# EAGLE design lcd_handle (EAGLE 5.12)

## Sheet 1 of 2
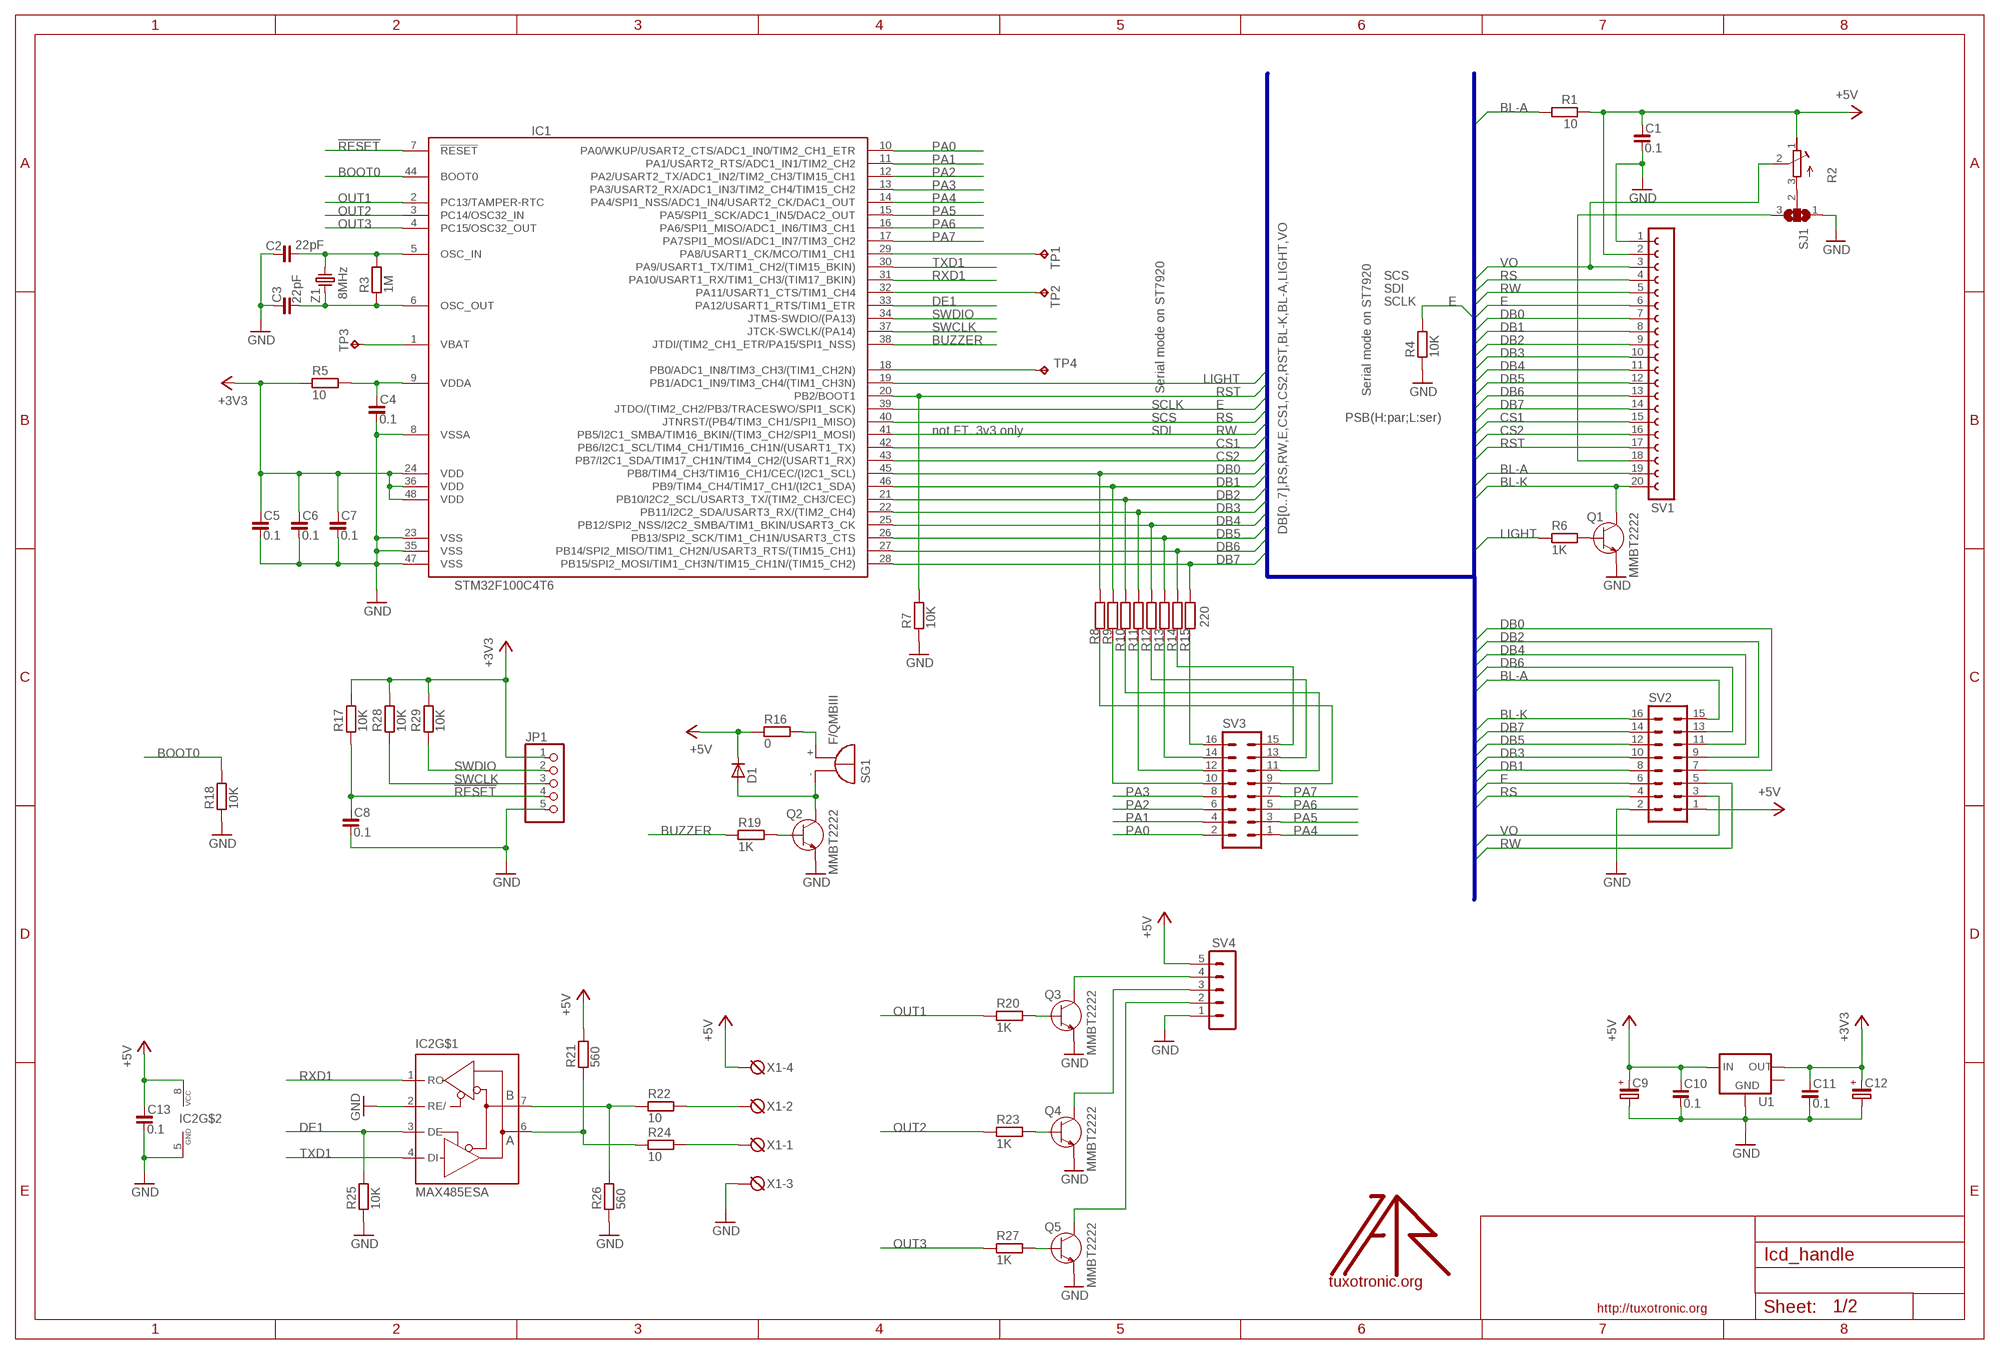
[diagram p0: schematic, sheet 1]

### Parts
C1  0.1  C_0805  [C0805]
C2  22pF  C_0603  [C0603]
C3  22pF  C_0603  [C0603]
C4  0.1  C_0603  [C0603]
C5  0.1  C_0603  [C0603]
C6  0.1  C_0603  [C0603]
C7  0.1  C_0603  [C0603]
C8  0.1  C_0603  [C0603]
C9  CP_SMCD  [SMC_D]
C10  0.1  C_0805  [C0805]
C11  0.1  C_0805  [C0805]
C12  CP_SMCD  [SMC_D]
C13  0.1  C_0603  [C0603]
D1  D-SOD-80  [SOD80]
IC1  STM32F100C4T6  [LQFP48]
IC2  MAX485ESA  MAX487-S  [SO08]
JP1  PINHD-1X5_2.00  [1X05M]
Q1  MMBT2222  BC847C  [SOT23]
Q2  MMBT2222  BC847C  [SOT23]
Q3  MMBT2222  BC847C  [SOT23]
Q4  MMBT2222  BC847C  [SOT23]
Q5  MMBT2222  BC847C  [SOT23]
R1  10  R_0805  [R0805]
R2  RTRIM  [RTRIM-3362P]
R3  1M  R_0603  [R0603]
R4  10K  R_0603  [R0603]
R5  10  R_0603  [R0603]
R6  1K  R_0603  [R0603]
R7  10K  R_0603  [R0603]
R8  220  R_0603  [R0603]
R9  220  R_0603  [R0603]
R10  220  R_0603  [R0603]
R11  220  R_0603  [R0603]
R12  220  R_0603  [R0603]
R13  220  R_0603  [R0603]
R14  220  R_0603  [R0603]
R15  220  R_0603  [R0603]
R16  0  R_0603  [R0603]
R17  10K  R_0603  [R0603]
R18  10K  R_0603  [R0603]
R19  1K  R_0603  [R0603]
R20  1K  R_0603  [R0603]
R21  560  R_0603  [R0603]
R22  10  R_0603  [R0603]
R23  1K  R_0603  [R0603]
R24  10  R_0603  [R0603]
R25  10K  R_0603  [R0603]
R26  560  R_0603  [R0603]
R27  1K  R_0603  [R0603]
R28  10K  R_0603  [R0603]
R29  10K  R_0603  [R0603]
SG1  F/QMBIII  [F/QMBIII]
SJ1  SJ2W  [SJ_2]
SV1  FE20-1  [FE20]
SV2  MA08-2  [MA08-2]
SV3  ML16L  [ML16L]
SV4  MA05-1  [MA05-1]
TP1  TPB1,27  [B1,27]
TP2  TPB1,27  [B1,27]
TP3  TPB1,27  [B1,27]
TP4  TPB1,27  [B1,27]
U1  LM1117-3.3  [SOT223]
U$  LOGO  [TT_LOGO]
X1  DG3XX-04-3.5  [DG350-3.5-04P]
Z1  8MHz  CRYSTAL-HC49S  [HC49/S]

### Nets
!RESET: C8.1 IC1.7(!RESET) JP1.4 R17.1
+3V3: C5.1 C6.1 C7.1 C11.1 C12.+ IC1.24(VDD) IC1.36(VDD) IC1.48(VDD) JP1.1 R5.1 R17.2 R28.2 R29.2 U1.2(OUT)
+5V: C1.1 C9.+ C10.1 C13.1 D1.C IC2.8(VCC) R1.1 R2.1(A) R16.1 R21.2 SV1.2 SV2.1 SV4.5 U1.3(IN) X1.4
BL-A: R1.2 SV1.19 SV2.15
BL-K: Q1.3(C) SV1.20 SV2.16
BOOT0: IC1.44(BOOT0) R18.2
BUZZER: IC1.38(JTDI/(TIM2_CH1_ETR/PA15/SPI1_NSS)) R19.1
CS1: IC1.42(PB6/I2C1_SCL/TIM4_CH1/TIM16_CH1N/(USART1_TX)) SV1.15
CS2: IC1.43(PB7/I2C1_SDA/TIM17_CH1N/TIM4_CH2/(USART1_RX)) SV1.16
DB0: IC1.45(PB8/TIM4_CH3/TIM16_CH1/CEC/(I2C1_SCL)) R8.2 SV1.7 SV2.7
DB1: IC1.46(PB9/TIM4_CH4/TIM17_CH1/(I2C1_SDA)) R9.2 SV1.8 SV2.8
DB2: IC1.21(PB10/I2C2_SCL/USART3_TX/(TIM2_CH3/CEC)) R10.2 SV1.9 SV2.9
DB3: IC1.22(PB11/I2C2_SDA/USART3_RX/(TIM2_CH4)) R11.2 SV1.10 SV2.10
DB4: IC1.25(PB12/SPI2_NSS/I2C2_SMBA/TIM1_BKIN/USART3_CK) R12.2 SV1.11 SV2.11
DB5: IC1.26(PB13/SPI2_SCK/TIM1_CH1N/USART3_CTS) R13.2 SV1.12 SV2.12
DB6: IC1.27(PB14/SPI2_MISO/TIM1_CH2N/USART3_RTS/(TIM15_CH1)) R14.2 SV1.13 SV2.13
DB7: IC1.28(PB15/SPI2_MOSI/TIM1_CH3N/TIM15_CH1N/(TIM15_CH2)) R15.2 SV1.14 SV2.14
DE1: IC1.33(PA12/USART1_RTS/TIM1_ETR) IC2.3(DE) R25.2
E: IC1.39(JTDO/(TIM2_CH2/PB3/TRACESWO/SPI1_SCK)) R4.2 SV1.6 SV2.6
GND: C1.2 C2.1 C3.1 C4.2 C5.2 C6.2 C7.2 C8.2 C9.- C10.2 C11.2 C12.- C13.2 IC1.8(VSSA) IC1.23(VSS) IC1.35(VSS) IC1.47(VSS) IC2.2(RE/) IC2.5(GND) JP1.5 Q1.2(E) Q2.2(E) Q3.2(E) Q4.2(E) Q5.2(E) R4.1 R7.1 R18.1 R25.1 R26.1 SJ1.1 SV1.1 SV2.2 SV4.1 U1.1(GND) X1.3 ; also sheet 2
LIGHT: IC1.19(PB1/ADC1_IN9/TIM3_CH4/(TIM1_CH3N)) R6.1
N$1: R2.3(E) SJ1.2
N$2: IC1.29(PA8/USART1_CK/MCO/TIM1_CH1) TP1.PP(TP)
N$3: Q3.1(B) R20.2
N$4: SJ1.3 SV1.18
N$5: R22.2 X1.2
N$6: Q2.1(B) R19.2
N$7: C4.1 IC1.9(VDDA) R5.2
N$8: D1.A Q2.3(C) SG1.-(+)
N$9: R16.2 SG1.+(-)
N$10: R24.2 X1.1
N$11: Q1.1(B) R6.2
N$12: IC2.7(B) R22.1 R26.2
N$13: IC2.6(A) R21.1 R24.1
N$14: R14.1 SV3.15
N$15: R12.1 SV3.13
N$16: C2.2 IC1.5(OSC_IN) R3.2 Z1.2
N$17: R10.1 SV3.11
N$18: R8.1 SV3.9
N$19: R15.1 SV3.16
N$20: R13.1 SV3.14
N$21: R11.1 SV3.12
N$22: R9.1 SV3.10
N$23: Q4.1(B) R23.2
N$24: Q5.1(B) R27.2
N$25: Q3.3(C) SV4.4
N$26: Q4.3(C) SV4.3
N$27: Q5.3(C) SV4.2
N$28: IC1.1(VBAT) TP3.PP(TP)
N$29: IC1.32(PA11/USART1_CTS/TIM1_CH4) TP2.PP(TP)
N$30: IC1.18(PB0/ADC1_IN8/TIM3_CH3/(TIM1_CH2N)) TP4.PP(TP)
OUT1: IC1.2(PC13/TAMPER-RTC) R20.1
OUT2: IC1.3(PC14/OSC32_IN) R23.1
OUT3: IC1.4(PC15/OSC32_OUT) R27.1
PA0: IC1.10(PA0/WKUP/USART2_CTS/ADC1_IN0/TIM2_CH1_ETR) SV3.2
PA1: IC1.11(PA1/USART2_RTS/ADC1_IN1/TIM2_CH2) SV3.4
PA2: IC1.12(PA2/USART2_TX/ADC1_IN2/TIM2_CH3/TIM15_CH1) SV3.6
PA3: IC1.13(PA3/USART2_RX/ADC1_IN3/TIM2_CH4/TIM15_CH2) SV3.8
PA4: IC1.14(PA4/SPI1_NSS/ADC1_IN4/USART2_CK/DAC1_OUT) SV3.1
PA5: IC1.15(PA5/SPI1_SCK/ADC1_IN5/DAC2_OUT) SV3.3
PA6: IC1.16(PA6/SPI1_MISO/ADC1_IN6/TIM3_CH1) SV3.5
PA7: IC1.17(PA7SPI1_MOSI/ADC1_IN7/TIM3_CH2) SV3.7
RS: IC1.40(JTNRST/(PB4/TIM3_CH1/SPI1_MISO)) SV1.4 SV2.4
RST: IC1.20(PB2/BOOT1) R7.2 SV1.17
RW: IC1.41(PB5/I2C1_SMBA/TIM16_BKIN/(TIM3_CH2/SPI1_MOSI)) SV1.5 SV2.5
RXD1: IC1.31(PA10/USART1_RX/TIM1_CH3/(TIM17_BKIN)) IC2.1(RO)
SWCLK: IC1.37(JTCK-SWCLK/(PA14)) JP1.3 R28.1
SWDIO: IC1.34(JTMS-SWDIO/(PA13)) JP1.2 R29.1
TXD1: IC1.30(PA9/USART1_TX/TIM1_CH2/(TIM15_BKIN)) IC2.4(DI)
VO: R2.2(S) SV1.3 SV2.3
XTAL2: C3.2 IC1.6(OSC_OUT) R3.1 Z1.1
Unconnected: U1.4(MASS)

### Buses
DB[0..7],RS,RW,E,CS1,CS2,RST,BL-K,BL-A,LIGHT,VO

### Notes on the sheet
- SCS
- SDI
- SCLK
- Serial mode on ST7920 | Serial mode on ST7920
- SCLK
- SCS | PSB(H:par;L:ser)
- not FT. 3v3 only | SDI

## Sheet 2 of 2
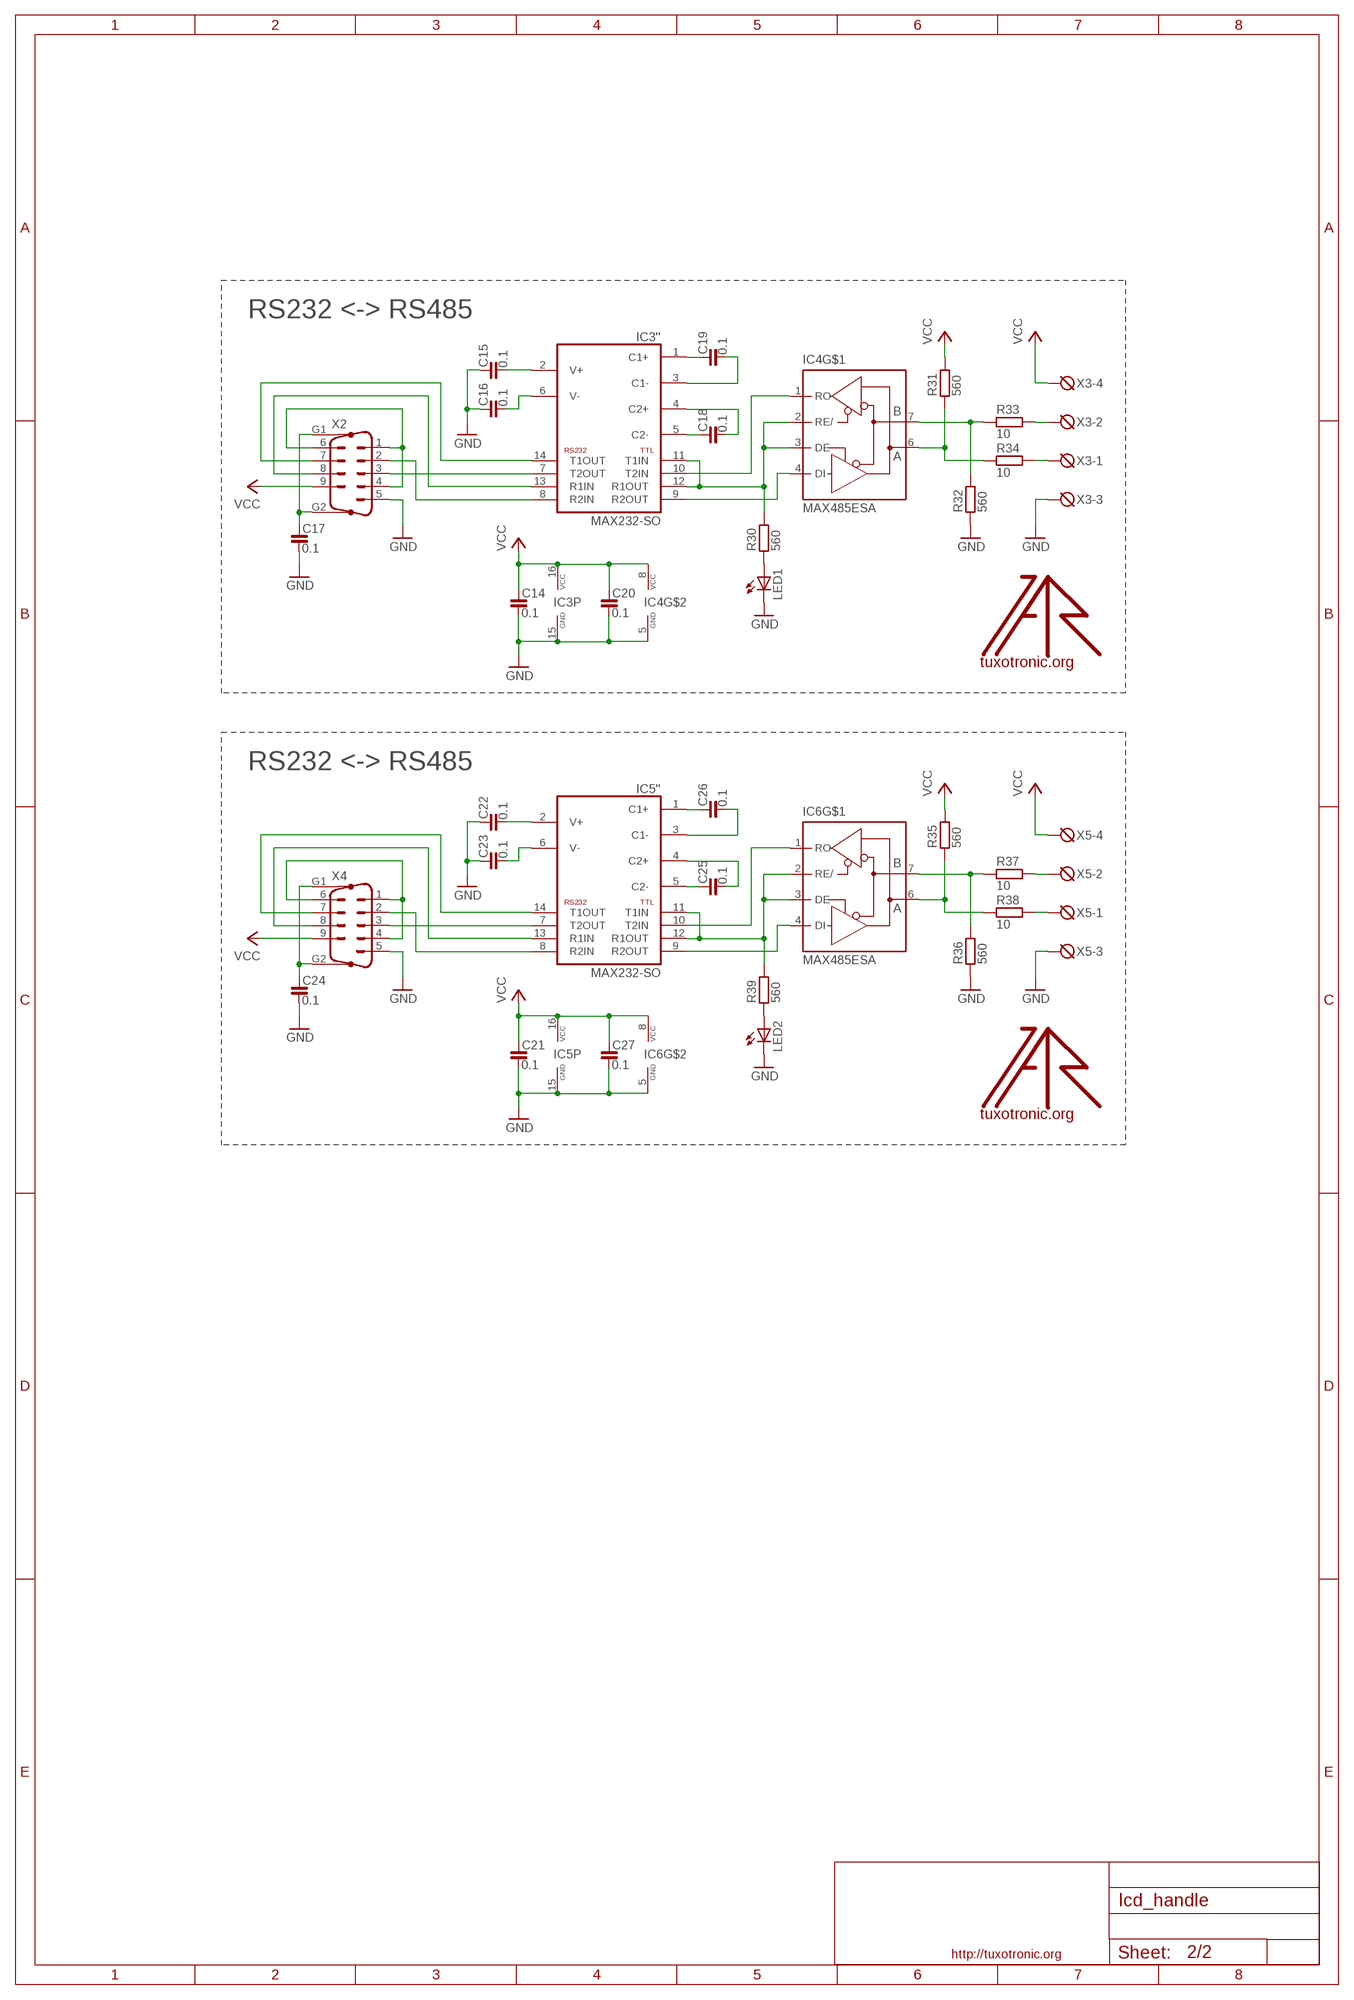
[diagram p1: schematic, sheet 2]

### Parts
C14  0.1  C_0805  [C0805]
C15  0.1  C_0805  [C0805]
C16  0.1  C_0805  [C0805]
C17  0.1  C_1206  [C1206]
C18  0.1  C_0805  [C0805]
C19  0.1  C_0805  [C0805]
C20  0.1  C_0805  [C0805]
C21  0.1  C_0805  [C0805]
C22  0.1  C_0805  [C0805]
C23  0.1  C_0805  [C0805]
C24  0.1  C_1206  [C1206]
C25  0.1  C_0805  [C0805]
C26  0.1  C_0805  [C0805]
C27  0.1  C_0805  [C0805]
IC3  MAX232-SO  [SO16]
IC4  MAX485ESA  MAX487-S  [SO08]
IC5  MAX232-SO  [SO16]
IC6  MAX485ESA  MAX487-S  [SO08]
LED1  LEDCHIP-LED0805  [CHIP-LED0805]
LED2  LEDCHIP-LED0805  [CHIP-LED0805]
R30  560  R_0805  [R0805]
R31  560  R_0805  [R0805]
R32  560  R_0805  [R0805]
R33  10  R_0805  [R0805]
R34  10  R_0805  [R0805]
R35  560  R_0805  [R0805]
R36  560  R_0805  [R0805]
R37  10  R_0805  [R0805]
R38  10  R_0805  [R0805]
R39  560  R_0805  [R0805]
U$1  LOGO  [TT_LOGO]
U$2  LOGO  [TT_LOGO]
X2  M09HP-9.4  [M09HP]
X3  DG3XX-04-3.5  [DG350-3.5-04P]
X4  M09HP-9.4  [M09HP]
X5  DG3XX-04-3.5  [DG350-3.5-04P]

### Nets
GND: C14.2 C15.1 C16.1 C17.2 C20.2 C21.2 C22.1 C23.1 C24.2 C27.2 IC3.15(P:GND) IC4.5(GND) IC5.15(P:GND) IC6.5(GND) LED1.C LED2.C R32.1 R36.1 X2.5 X3.3 X4.5 X5.3 ; also sheet 1
N$31: IC3.7('':T2OUT) X2.3
N$32: C16.2 IC3.6('':V-)
N$33: C15.2 IC3.2('':V+)
N$34: C17.1 X2.G1 X2.G2
N$35: X2.1 X2.4 X2.6
N$36: C18.1 IC3.5('':C2-)
N$37: C18.2 IC3.4('':C2+)
N$38: C19.2 IC3.3('':C1-)
N$39: C19.1 IC3.1('':C1+)
N$40: IC4.7(B) R32.2 R33.1
N$41: IC4.6(A) R31.1 R34.1
N$42: R33.2 X3.2
N$43: R34.2 X3.1
N$44: IC3.8('':R2IN) X2.2
N$45: IC3.14('':T1OUT) X2.7
N$46: IC3.13('':R1IN) X2.8
N$47: IC5.11('':T1IN) IC5.12('':R1OUT) IC6.2(RE/) IC6.3(DE) R39.2
N$48: IC3.9('':R2OUT) IC4.4(DI)
N$49: IC3.10('':T2IN) IC4.1(RO)
N$50: LED1.A R30.1
N$51: C23.2 IC5.6('':V-)
N$52: C22.2 IC5.2('':V+)
N$53: C24.1 X4.G1 X4.G2
N$54: X4.1 X4.4 X4.6
N$55: C25.1 IC5.5('':C2-)
N$56: C25.2 IC5.4('':C2+)
N$57: C26.2 IC5.3('':C1-)
N$58: C26.1 IC5.1('':C1+)
N$59: IC6.7(B) R36.2 R37.1
N$60: IC6.6(A) R35.1 R38.1
N$61: R37.2 X5.2
N$62: R38.2 X5.1
N$63: IC5.7('':T2OUT) X4.3
N$64: IC5.8('':R2IN) X4.2
N$65: IC5.14('':T1OUT) X4.7
N$66: IC5.13('':R1IN) X4.8
N$68: IC5.9('':R2OUT) IC6.4(DI)
N$69: IC5.10('':T2IN) IC6.1(RO)
N$70: LED2.A R39.1
N$71: IC3.11('':T1IN) IC3.12('':R1OUT) IC4.2(RE/) IC4.3(DE) R30.2
VCC: C14.1 C20.1 C21.1 C27.1 IC3.16(P:VCC) IC4.8(VCC) IC5.16(P:VCC) IC6.8(VCC) R31.2 R35.2 X2.9 X3.4 X4.9 X5.4

### Notes on the sheet
- RS232 <-> RS485
- RS232 <-> RS485

## Library data of the parts
C1-C8 C10 C11 C13-C27 = rc-master-smd:C_: NON-POLARIZED CAP
C9 C12 = rc-master-smd:CP_: POLARIZED CAP
D1 = diodes:D-: DIODE
IC1 = stm32:STM32F100C: Medium-density performance line ARM-based 32-bit MCU with 64 or 128 KB Flash, USB, CAN, 7 timers, 2 ADCs, 9 communication interfaces
IC2 IC4 IC6 = rs232-rs485:MAX487: RS485 TRANSEIVER
IC3 IC5 = rs232-rs485:MAX232: RS232 TRANSEIVER
JP1 = pinhead-fixdrills:PINHD-1X5: PIN HEADER
LED1 LED2 = led:LED: LED OSRAM: - CHIPLED LG R971, LG N971, LY N971, LG Q971, LY Q971, LO R971, LY R971 LH N974, LH R974 LS Q976, LO Q976, LY Q976 LO Q996 - Hyper CHIPLED LW Q18S LB Q993, LB Q99A, LB R99A - SideLED LS A670, LO A670, LY A670, LG A670, LP A670 LB A673, LV A673, LT A673, LW A673 LH A674 LY A675 LS A676, LA A676, LO A676, LY A676, LW A676 LS A679, LY A679, LG A679 - Hyper Micro SIDELED® LS Y876, LA Y876, LO Y876, LY Y876 LT Y87S - SmartLED LW L88C, LW L88S LB L89C, LB L89S, LG L890 LS L89K, LO L89K, LY L89K LS L896, LA L896, LO L896, LY L896 - TOPLED LS T670, LO T670, LY T670, LG T670, LP T670 LSG T670, LSP T670, LSY T670, LOP T670, LYG T670 LG T671, LOG T671, LSG T671 LB T673, LV T673, LT T673, LW T673 LH T674 LS T676, LA T676, LO T676, LY T676, LB T676, LH T676, LSB T676, LW T676 LB T67C, LV T67C, LT T67C, LS T67K, LO T67K, LY T67K, LW E67C LS E67B, LA E67B, LO E67B, LY E67B, LB E67C, LV E67C, LT E67C LW T67C LS T679, LY T679, LG T679 LS T770, LO T770, LY T770, LG T770, LP T770 LB T773, LV T773, LT T773, LW T773 LH T774 LS E675, LA E675, LY E675, LS T675 LS T776, LA T776, LO T776, LY T776, LB T776 LHGB T686 LT T68C, LB T68C - Hyper Mini TOPLED® LB M676 - Mini TOPLED Santana® LG M470 LS M47K, LO M47K, LY M47K Source: http://www.osram.convergy.de - LUMILED® LXK2-PW12-R00, LXK2-PW12-S00, LXK2-PW14-U00, LXK2-PW14-V00 LXK2-PM12-R00, LXK2-PM12-S00, LXK2-PM14-U00 LXK2-PE12-Q00, LXK2-PE12-R00, LXK2-PE12-S00, LXK2-PE14-T00, LXK2-PE14-U00 LXK2-PB12-K00, LXK2-PB12-L00, LXK2-PB12-M00, LXK2-PB14-N00, LXK2-PB14-P00, LXK2-PB14-Q00 LXK2-PR12-L00, LXK2-PR12-M00, LXK2-PR14-Q00, LXK2-PR14-R00 LXK2-PD12-Q00, LXK2-PD12-R00, LXK2-PD12-S00 LXK2-PH12-R00, LXK2-PH12-S00 LXK2-PL12-P00, LXK2-PL12-Q00, LXK2-PL12-R00 Source: www.luxeon.com
Q1-Q5 = semiconductor:BC847: Bipolar transistor NPN-structure
R1 R3-R39 = rc-master-smd:R_: RESISTOR
R2 = lcd-char:RTRIM
SG1 = buzzer:F/QMBIII: BUZZER Source: Buerklin
SJ1 = discrete:SJ2W: SMD solder JUMPER
SV1 = interfaces:FE20-1: FEMALE HEADER
SV2 = con-lstb:MA08-2: PIN HEADER
SV3 = con-ml:ML16L: HARTING
SV4 = con-lstb:MA05-1: PIN HEADER
TP1-TP4 = testpad:TP: Test pad
U1 = vreg-linear:LM1117: Linear regulators
U$ U$1 U$2 = logo:LOGO
X1 X3 X5 = degson:DG3XX-04: DG350-3.5-04P DG306-5.0-04P
X2 X4 = sub-d:M09HP: SUB-D
Z1 = discrete:CRYSTAL-: CRYSTAL

## Net classes
0 default: width 0.1 mm, drill 0.1 mm, clearance 0.1 mm

## Board
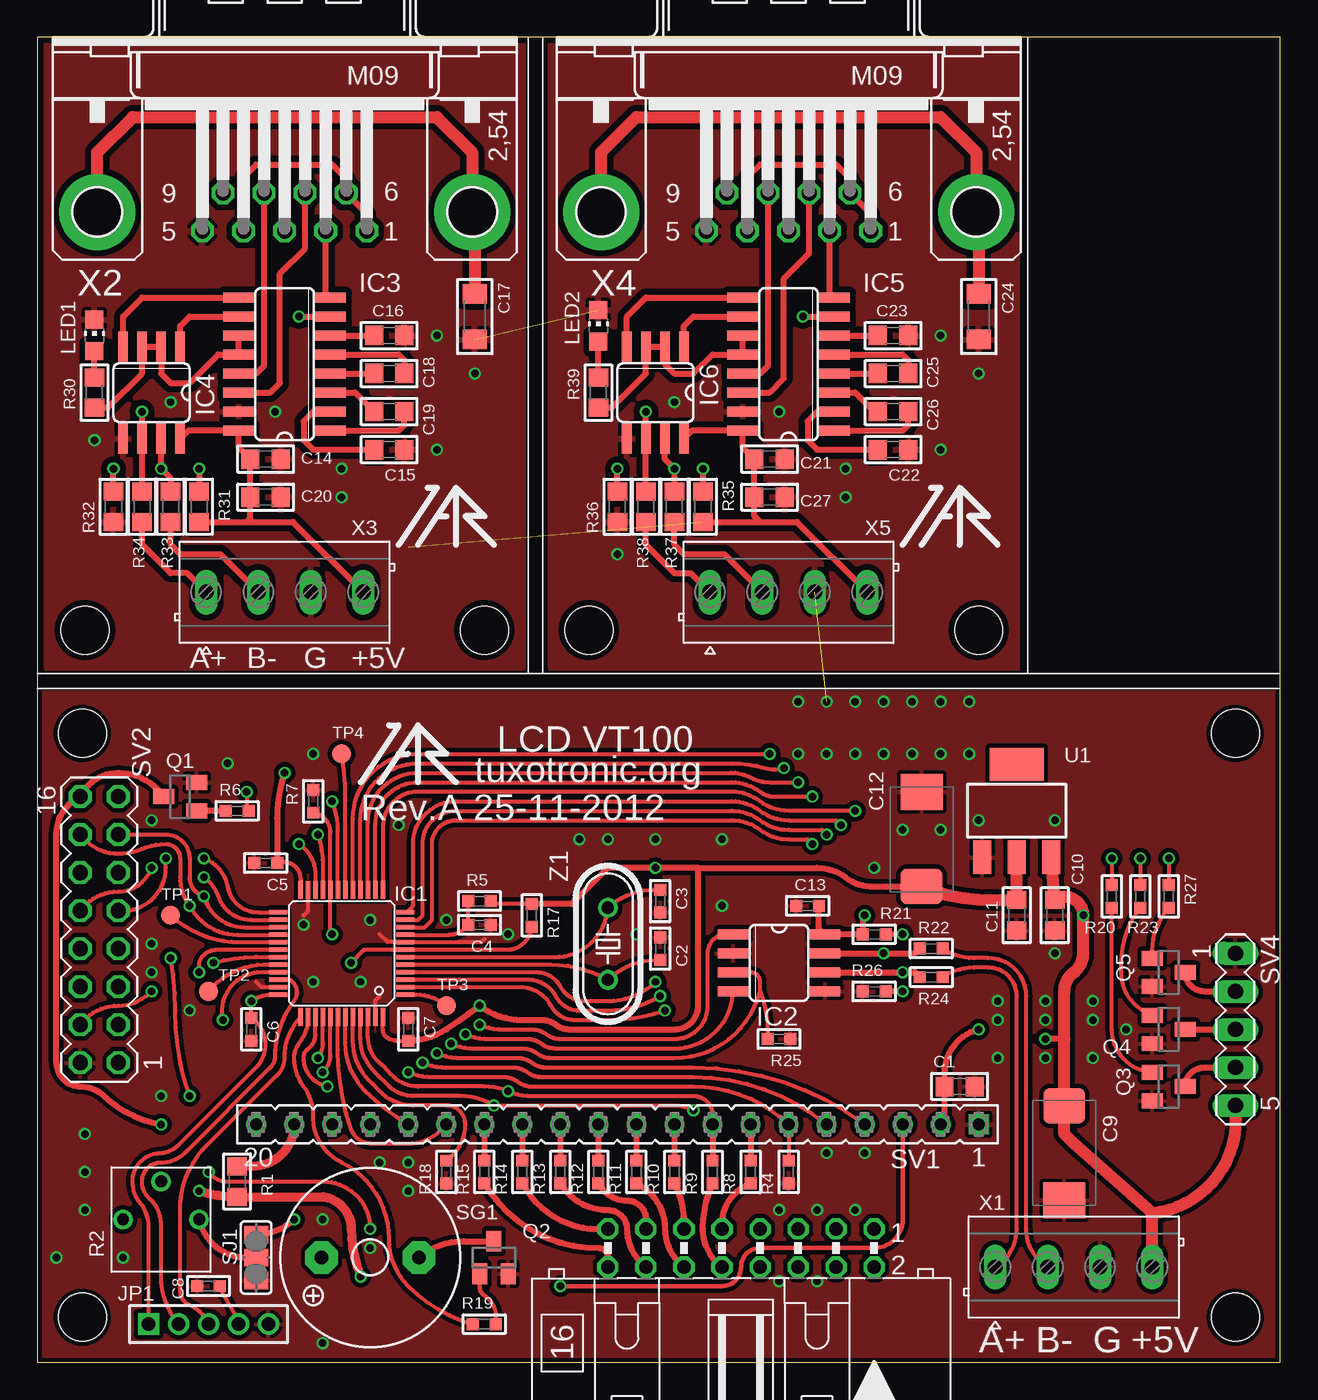
[diagram p2: board, top side]
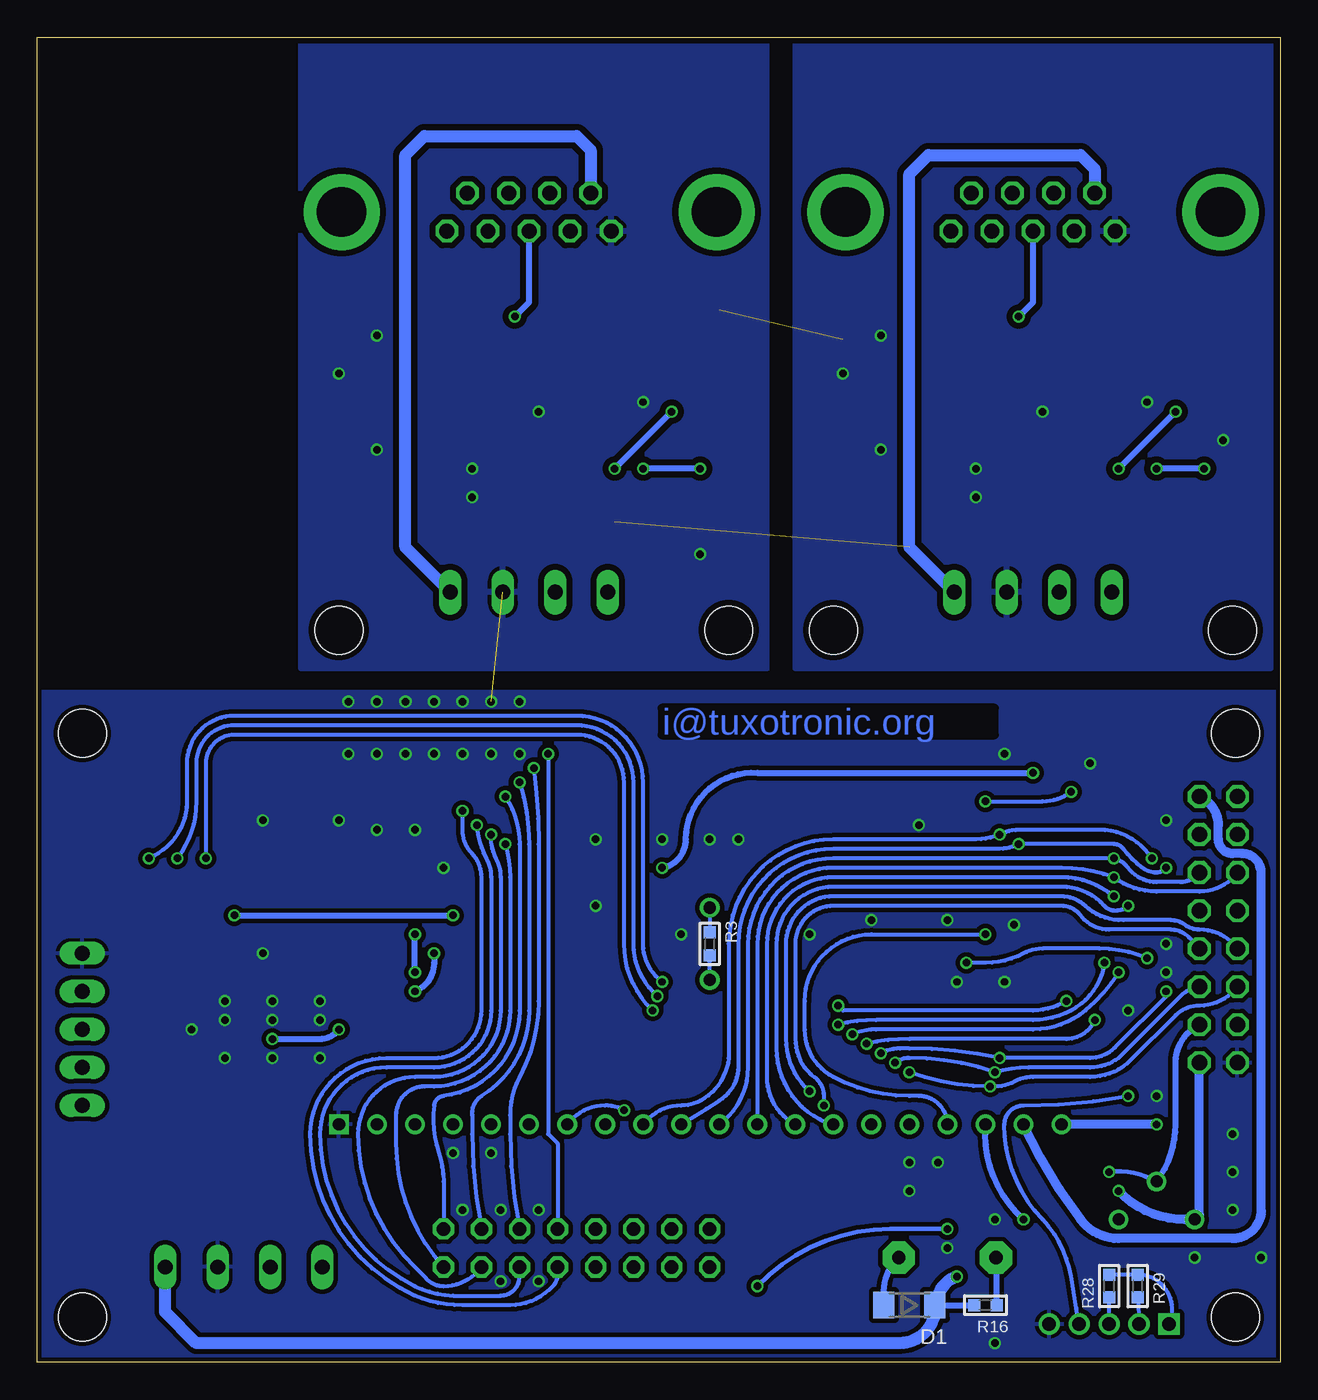
[diagram p3: board, bottom side, seen from below]

Size 83 x 88.5 mm. Coordinates in mm from the lower left corner, seen from the top.
Outline: 0,0 83,0 83,88.5 0,88.5 0,0
Copper layers (1*16): Top 0.035mm / dielectric 1.5mm / Bottom 0.035mm
Design rules "Fusion_eagle_rule_v1.1": minimum track width 6mil, minimum drill 12mil, track to track 6mil, track to pad 6mil, pad to pad 6mil, via to via 6mil, smd to smd 0mil, copper to edge 10mil, drill to drill 10mil, minimum pad ring 10mil, minimum via ring 6mil, stop-mask expansion 2mil, vias tented up to drill 100mil, thermal gap 10mil
Holes 3.2 mm at 3,3 80,3 80,42 3,42 3.17,48.9 29.84,48.9 36.83,48.9 62.87,48.9

### Footprints (pad centres in the part's own frame; a part is rotated, then mirrored left to right if it is on the bottom)
C0805 = smd 1.2 x 1.3: 1 -1.016,0; 2 1.016,0
C0603 = smd 0.8 x 0.8: 1 -0.762,0; 2 0.762,0
SMC_D = smd 2.4 x 2.8: + -3.15,0; - 3.15,0
C1206 = smd 1.3 x 1.6: 1 -1.524,0; 2 1.524,0
SOD80 = smd 1.4 x 1.8: A 1.7,0; C -1.7,0
LQFP48 = smd 0.3 x 1.2: 1 -2.75,-4.25; 2 -2.25,-4.25; 3 -1.75,-4.25; 4 -1.25,-4.25; 5 -0.75,-4.25; 6 -0.25,-4.25; 7 0.25,-4.25; 8 0.75,-4.25; 9 1.25,-4.25; 10 1.75,-4.25; 11 2.25,-4.25; 12 2.75,-4.25; 25 2.75,4.25; 26 2.25,4.25; 27 1.75,4.25; 28 1.25,4.25; 29 0.75,4.25; 30 0.25,4.25; 31 -0.25,4.25; 32 -0.75,4.25; 33 -1.25,4.25; 34 -1.75,4.25; 35 -2.25,4.25; 36 -2.75,4.25 | smd 1.2 x 0.3: 13 4.25,-2.75; 14 4.25,-2.25; 15 4.25,-1.75; 16 4.25,-1.25; 17 4.25,-0.75; 18 4.25,-0.25; 19 4.25,0.25; 20 4.25,0.75; 21 4.25,1.25; 22 4.25,1.75; 23 4.25,2.25; 24 4.25,2.75; 37 -4.25,2.75; 38 -4.25,2.25; 39 -4.25,1.75; 40 -4.25,1.25; 41 -4.25,0.75; 42 -4.25,0.25; 43 -4.25,-0.25; 44 -4.25,-0.75; 45 -4.25,-1.25; 46 -4.25,-1.75; 47 -4.25,-2.25; 48 -4.25,-2.75
SO08 = smd 0.66 x 2.032: 1 -1.905,-3.073; 2 -0.635,-3.073; 3 0.635,-3.073; 4 1.905,-3.073; 5 1.905,3.073; 6 0.635,3.073; 7 -0.635,3.073; 8 -1.905,3.073
SO16 = smd 0.66 x 2.032: 1 -4.445,-3.073; 2 -3.175,-3.073; 3 -1.905,-3.073; 4 -0.635,-3.073; 5 0.635,-3.073; 6 1.905,-3.073; 7 3.175,-3.073; 8 4.445,-3.073; 9 4.445,3.073; 10 3.175,3.073; 11 1.905,3.073; 12 0.635,3.073; 13 -0.635,3.073; 14 -1.905,3.073; 15 -3.175,3.073; 16 -4.445,3.073
1X05M = drill 0.9 square: 1 -4,0 | drill 0.9 round: 2 -2,0; 3 0,0; 4 2,0; 5 4,0
CHIP-LED0805 = smd 1.2 x 1.2: A 0,-1.05; C 0,1.05
SOT23 = smd 1 x 1.4: 1 -0.95,-1.1; 2 0.95,-1.1; 3 0,1.1
R0805 = smd 1.2 x 1.3: 1 -1.016,0; 2 1.016,0
RTRIM-3362P = drill 0.8 round: 1 -2.54,0; 2 0,2.54; 3 2.54,0
R0603 = smd 0.8 x 0.8: 1 -0.762,0; 2 0.762,0
F/QMBIII = drill 0.9 pad 2.159 octagon: + 3.251,0; - -3.251,0
SJ_2 = smd 1.168 x 1.6: 1 -1.524,0; 2 0,0; 3 1.524,0
FE20 = drill 0.813 square: 1 -24.13,0 | drill 0.813 round: 2 -21.59,0; 3 -19.05,0; 4 -16.51,0; 5 -13.97,0; 6 -11.43,0; 7 -8.89,0; 8 -6.35,0; 9 -3.81,0; 10 -1.27,0; 11 1.27,0; 12 3.81,0; 13 6.35,0; 14 8.89,0; 15 11.43,0; 16 13.97,0; 17 16.51,0; 18 19.05,0; 19 21.59,0; 20 24.13,0
MA08-2 = drill 1.016 octagon: 1 -8.89,-1.27; 2 -8.89,1.27; 3 -6.35,-1.27; 4 -6.35,1.27; 5 -3.81,-1.27; 6 -3.81,1.27; 7 -1.27,-1.27; 8 -1.27,1.27; 9 1.27,-1.27; 10 1.27,1.27; 11 3.81,-1.27; 12 3.81,1.27; 13 6.35,-1.27; 14 6.35,1.27; 15 8.89,-1.27; 16 8.89,1.27
ML16L = drill 0.9 octagon: 1 -8.89,-1.27; 2 -8.89,1.27; 3 -6.35,-1.27; 4 -6.35,1.27; 5 -3.81,-1.27; 6 -3.81,1.27; 7 -1.27,-1.27; 8 -1.27,1.27; 9 1.27,-1.27; 10 1.27,1.27; 11 3.81,-1.27; 12 3.81,1.27; 13 6.35,-1.27; 14 6.35,1.27; 15 8.89,-1.27; 16 8.89,1.27
MA05-1 = drill 1.016 long: 1 -5.08,0; 2 -2.54,0; 3 0,0; 4 2.54,0; 5 5.08,0
B1,27 = smd 1.27 x 1.27: PP 0,0
SOT223 = smd 1.219 x 2.235: 1 -2.311,-3.099; 2 0,-3.099; 3 2.311,-3.099 | smd 3.6 x 2.2: 4 0,3.099
DG350-3.5-04P = drill 1 long: 1 -5.25,0; 2 -1.75,0; 3 1.75,0; 4 5.25,0
M09HP = drill 1 octagon: 1 -5.486,1.27; 2 -2.743,1.27; 3 0,1.27; 4 2.743,1.27; 5 5.486,1.27; 6 -4.115,-1.27; 7 -1.372,-1.27; 8 1.372,-1.27; 9 4.115,-1.27 | drill 3.3 pad 5.08 round: G1 -12.522,0; G2 12.522,0
HC49/S = drill 0.813 round: 1 -2.413,0; 2 2.413,0

### Placement (x,y rotation side)
C1  61.59,18.41 0 top
C2  41.59,27.62 270 top
C3  41.59,30.8 90 top
C4  29.53,29.21 0 top
C5  15.24,33.34 180 top
C6  14.29,22.23 270 top
C7  24.77,22.23 90 top
C8  11.43,5.08 180 top
C9  68.58,13.97 270 top
C10  67.94,29.84 270 top
C11  65.41,29.84 270 top
C12  59.05,34.92 90 top
C13  51.44,30.48 180 top
C14  15.24,60.33 0 top
C15  23.5,60.96 180 top
C16  23.5,68.58 180 top
C17  29.21,69.85 270 top
C18  23.5,66.04 180 top
C19  23.5,63.5 180 top
C20  15.24,57.78 0 top
C21  48.9,60.33 0 top
C22  57.15,60.96 180 top
C23  57.15,68.58 180 top
C24  62.87,69.85 270 top
C25  57.15,66.04 180 top
C26  57.15,63.5 180 top
C27  48.9,57.78 0 top
D1  24.77,3.81 180 bottom
IC1  20.32,27.3 90 top
IC2  49.53,26.67 270 top
IC3  16.51,66.67 90 top
IC4  7.62,64.77 180 top
IC5  50.16,66.67 90 top
IC6  41.27,64.77 180 top
JP1  11.43,2.54 0 top
LED1  3.81,68.58 0 top
LED2  37.47,69.22 0 top
Q1  9.53,37.78 90 top
Q2  30.48,6.99 0 top
Q3  75.56,18.41 270 top
Q4  75.56,22.23 270 top
Q5  75.56,26.04 270 top
R1  13.34,12.06 90 top
R2  8.26,9.53 0 top
R3  38.1,27.94 270 bottom
R4  50.16,12.7 90 top
R5  29.53,30.8 180 top
R6  13.34,36.83 180 top
R7  18.41,37.47 270 top
R8  47.62,12.7 90 top
R9  45.09,12.7 90 top
R10  42.55,12.7 90 top
R11  40.01,12.7 90 top
R12  37.47,12.7 90 top
R13  34.92,12.7 90 top
R14  32.38,12.7 90 top
R15  29.84,12.7 90 top
R16  19.68,3.81 0 bottom
R17  33.02,29.84 90 top
R18  27.3,12.7 90 top
R19  29.84,2.54 0 top
R20  71.75,31.11 270 top
R21  55.88,28.57 180 top
R22  59.69,27.62 0 top
R23  73.66,31.11 270 top
R24  59.69,25.72 0 top
R25  49.53,21.59 180 top
R26  55.88,24.77 0 top
R27  75.56,31.11 270 top
R28  11.43,5.08 90 bottom
R29  9.53,5.08 90 bottom
R30  3.81,64.77 270 top
R31  10.79,57.15 270 top
R32  5.08,57.15 90 top
R33  8.89,57.15 270 top
R34  6.99,57.15 270 top
R35  44.45,57.15 270 top
R36  38.73,57.15 90 top
R37  42.55,57.15 270 top
R38  40.64,57.15 270 top
R39  37.47,64.77 270 top
SG1  22.23,6.99 180 top
SJ1  14.61,6.99 90 top
SV1  38.73,15.88 180 top
SV2  4.13,28.89 90 top
SV3  46.99,7.62 180 top
SV4  80.01,22.23 270 top
TP1  8.89,29.84 0 top
TP2  11.43,24.77 0 top
TP3  27.3,23.81 0 top
TP4  20.32,40.64 0 top
U1  65.41,36.83 0 top
U$  25.4,41.27 0 top
U$1  27.94,57.15 0 top
U$2  61.59,57.15 0 top
X1  69.22,6.35 0 top
X2  16.51,76.83 180 top
X3  16.51,51.44 0 top
X4  50.16,76.83 180 top
X5  50.16,51.44 0 top
Z1  38.1,27.94 270 top

### Tracks (layer width: path | path; a pad name or v marks a point on that pad's centre or on a via)
!RESET  (via drill 0.5)
  Top 0.254: v20.95,26.67 21.84,27.55 IC1.7 31.36,27.55 arc85 R17.1 | C8.1 12.19,4.95 13.43,2.76 JP1.4 | v10.16,17.78 arc-19 9.21,23.5 arc10 v8.89,26.99
  Bottom 0.254: v20.95,26.67 19.68,26.67 arc-28 17.14,27.3 arc28 15.88,27.62 12.06,27.62 arc23 v8.89,26.99 | v10.16,17.78 arc10 17.14,17.14 arc-90 18.41,15.88 arc-44 15.88,9.53 arc34 13.97,5.71 arc0 JP1.4
+3V3  (via drill 0.5)
  Top 0.254: JP1.1 7.43,9.08 arc35 6.99,10.48 arc-44 6.35,12.06 arc-90 8.26,13.97 arc44 9.53,14.61 14.61,19.68 arc46 15.24,21.27 arc55 C6.1 v14.29,24.13 arc-34 15.66,24.55 IC1.36 | IC1.24 17.57,32.28 arc112 C5.1 | R17.2 30.16,30.61 R5.1 | IC1.48 23.07,22.21 arc69 23.5,21.59 arc30 C7.1
  Top 0.406: C12.+ 55.85,31.77 arc-38 53.98,32.38 arc37 52.07,33.02 44.13,33.02 | 44.13,33.02 44.13,23.81 arc-90 42.55,22.23 35.56,22.23 arc-37 34.61,22.54 arc37 33.66,22.86 32.38,22.86 arc-37 v29.53,23.81 arc-4 27.3,22.23 arc-33 C7.1 | C5.1 16,36.32 arc-19 v16.51,39.37 | R17.2 35.69,30.61 38.1,33.02 v41.27,33.02 44.13,33.02
  Top 0.813: U1.2 C11.1 63.8,30.86 arc-22 C12.+
  Bottom 0.254: v29.53,23.81 29.21,23.5 16.51,23.5 arc-32 v14.29,24.13 | R28.2 R29.2 arc115 JP1.1
  Bottom 0.406: v16.51,39.37 34.92,39.37 arc-94 39.69,34.92 arc80 v41.27,33.02
+5V  (via drill 0.5)
  Top 0.305: 60.58,16.13 SV1.2
  Top 0.406: 60.58,16.13 C1.1 60.58,19.3 arc-76 v62.87,22.23 | C13.1 52.2,28.98 IC2.8 R21.2 55.12,29.72 v55.24,29.84 | 68.58,21.59 v67.31,21.59
  Top 0.61: v21.59,5.71 arc-23 20.95,8.89 arc81 19.11,11.05 R1.1 arc-17 v10.79,11.43
  Top 0.813: X1.4 74.47,9.96 | 74.47,9.96 69.22,14.61 68.58,15.24 C9.+ 68.58,21.59 68.58,24.77 arc-53 69.22,26.04 arc53 69.85,27.3 v69.85,29.84 arc124 C10.1 U1.3 | SV4.5 80.01,16.78 arc-90 74.47,9.96
  Bottom 0.406: v67.31,21.59 64.14,21.59 arc-53 v62.87,22.23 | v69.85,29.84 v55.24,29.84 | D1.C R16.1
  Bottom 0.61: SV2.1 5.4,9.84 R2.1 6.35,9.53 arc46 v10.79,11.43
  Bottom 0.813: X1.4 74.47,3.35 72.39,1.27 25.4,1.27 arc-95 D1.C 22.86,4.45 arc54 v21.59,5.71
BL-A
  Top 0.61: R1.2 14.35,13.08 arc90 SV1.19
  Bottom 0.61: SV1.19 arc-12 13.34,9.53 arc-53 10.79,8.26 3.17,8.26 arc-90 1.27,10.16 1.27,32.7 arc-90 2.54,33.97 3.17,33.97 arc90 4.13,34.92 4.13,35.88 arc-67 SV2.15
BL-K  (via drill 0.5)
  Top 0.406: v8.26,15.88 arc-34 4.45,17.78 arc44 2.86,18.41 arc-90 1.27,20 1.27,35.24 arc-64 SV2.16 arc-64 5.4,39.37 arc-55 Q1.3
  Bottom 0.61: v8.26,15.88 SV1.20
BOOT0
  Top 0.254: R18.2 arc56 28.57,15.88 arc90 27.3,17.14 25.08,17.14 arc-46 22.86,18.1 22.38,18.57 arc-49 21.07,21.48 IC1.44
BUZZER
  Top 0.254: IC1.38 18.07,22.54 arc-23 17.46,21.27 arc37 17.14,20.32 arc37 17.78,18.41 arc-37 18.41,16.51 arc66 20.32,13.34 arc-64 23.5,8.26 arc46 24.77,5.08 arc29 R19.1
CS1
  Top 0.254: IC1.42 20.07,20.89 arc19 20.95,15.56 arc69 22.23,14.61 24.77,14.61 arc53 SV1.15
CS2
  Top 0.254: IC1.43 20.57,21.34 arc45 21.91,18.1 arc15 SV1.16
DB0  (via drill 0.5)
  Top 0.254: v43.81,16.83 arc28 42.55,17.14 v30.48,17.14 arc32 28.26,17.78 25.08,17.78 arc-44 23.5,18.41 22.54,19.37 arc-47 21.57,21.61 IC1.45
  Top 0.406: SV1.7 R8.2
  Bottom 0.254: v30.48,17.14 30.48,17.78 arc-53 31.11,19.05 arc53 32.38,21.59 32.38,27.94 arc90 29.84,30.48 14.61,30.48 arc53 13.34,29.84 arc-53 11.43,28.89 7.3,28.89 arc37 6.35,28.57 arc16 SV2.7 | v43.81,16.83 arc-28 45.09,17.14 arc-53 SV1.7
DB1  (via drill 0.5)
  Top 0.254: SV1.8 45.09,16.51 arc90 43.81,17.78 33.02,17.78 arc-23 v31.43,18.1 arc23 29.84,18.41 25.4,18.41 arc-53 23.5,19.37 23.02,19.84 arc-53 22.07,21.75 IC1.46
  Top 0.406: SV1.8 R9.2
  Bottom 0.254: v31.43,18.1 arc49 33.02,21.59 33.02,27.94 arc90 29.84,31.11 14.61,31.11 arc44 13.02,30.48 arc-46 10.48,29.53 7.3,29.53 arc37 6.35,29.21 arc-37 5.4,28.89 arc53 SV2.8
DB2  (via drill 0.5)
  Top 0.254: v8.57,33.66 8.57,33.02 arc-96 SV2.9 | IC1.21 19.07,33 arc17 v18.73,35.24
  Top 0.406: SV1.9 R10.2
  Bottom 0.254: SV1.9 arc53 40.01,17.14 arc-28 38.73,17.46 arc-56 36.83,20.32 36.83,27.94 arc90 29.84,34.92 20.32,34.92 arc-23 v18.73,35.24 arc28 17.46,35.56 12.06,35.56 arc57 v8.57,33.66
DB3  (via drill 0.5)
  Top 0.254: IC1.22 18.57,32.55 arc57 v17.46,34.61 | SV2.10 arc-53 5.4,31.43 arc71 v7.62,33.02
  Top 0.406: SV1.10 R11.2
  Bottom 0.254: SV1.10 arc-1 37.47,17.46 arc-58 36.2,19.77 36.2,27.94 arc90 29.84,34.29 18.73,34.29 arc-28 v17.46,34.61 11.11,34.61 arc53 10.48,34.29 arc-16 9.21,33.02 arc-37 8.26,32.7 arc-53 v7.62,33.02
DB4  (via drill 0.5)
  Top 0.254: IC1.25 14.71,30.05 arc-80 12.7,31.75 arc60 v11.11,33.66
  Top 0.406: SV1.11 R12.2
  Bottom 0.254: SV1.11 arc-53 35.56,19.68 35.56,27.94 arc90 29.84,33.66 v11.11,33.66 arc39 10.16,33.02 arc-53 8.26,32.07 6.67,32.07 arc-53 SV2.11
DB5  (via drill 0.5)
  Top 0.254: IC1.26 14.26,29.55 arc-71 12.06,31.11 arc35 v11.11,32.38
  Top 0.406: SV1.12 R13.2
  Bottom 0.254: SV1.12 34.92,27.94 arc90 29.84,33.02 14.61,33.02 arc21 v11.11,32.38 arc-37 8.26,31.43 5.4,31.43 arc-53 SV2.12
DB6  (via drill 0.5)
  Top 0.254: IC1.27 13.81,29.05 arc-75 v11.11,31.11 arc-74 10.16,32.38 10.16,33.66 arc90 8.57,35.24 SV2.13
  Top 0.406: SV1.13 R14.2
  Bottom 0.254: SV1.13 arc62 34.29,19.05 34.29,27.94 arc90 29.84,32.38 14.61,32.38 arc40 v11.11,31.11
DB7  (via drill 0.5)
  Top 0.254: IC1.28 13.36,28.55 arc-62 v10.16,30.48 arc-37 9.53,32.38 9.53,33.66 arc90 8.57,34.61 arc23 6.99,34.29 arc-23 5.4,33.97 arc-53 SV2.14
  Top 0.406: SV1.14 R15.2
  Bottom 0.254: v10.16,30.48 arc47 11.11,30.16 arc43 11.75,30.48 arc-48 14.61,31.75 29.84,31.75 arc-90 33.66,27.94 33.66,20.95 arc-74 SV1.14
DE1  (via drill 0.5)
  Top 0.254: IC1.33 14.94,26.05 arc60 12.7,24.77 arc41 v12.38,22.86 | 48.26,24.77 arc-76 42.55,20.32 34.29,20.32 arc-37 33.34,20.64 arc37 32.38,20.95 29.21,20.95 arc-23 v27.62,21.27 | IC2.3 47.62,26.04 arc-90 48.26,25.4 48.26,24.77 | R25.2 48.77,22.1 arc22 48.26,24.77
  Bottom 0.254: v27.62,21.27 arc13 24.77,21.59 14.29,21.59 arc-67 v12.38,22.86
E  (via drill 0.5)
  Top 0.254: IC1.39 18.57,21.91 arc-54 18.1,20.95 arc53 17.78,20.32 arc80 v19.37,18.41 | R4.2 SV1.6 arc44 43.81,18.41 33.02,18.41 arc-37 32.07,18.73 arc37 31.11,19.05 26.35,19.05 arc-23 v24.77,19.37
  Bottom 0.254: v24.77,19.37 arc-20 v19.37,18.41 19.05,18.41 arc-28 17.78,18.73 arc28 16.51,19.05 12.7,19.05 arc-45 10,20.16 6.99,23.18 arc44 5.4,23.81 arc-53 SV2.6
GND  (via drill 0.5)  (2 unrouted)
  Top 0.254: IC1.47 22.57,24.16 22.86,24.45 | IC1.23 18.07,30.14 17.78,29.84 | 29.84,28.26 29.64,28.05 IC1.8 23.38,28.05 22.86,28.57 | IC1.35 14.95,25.05 14.61,25.4
  other vias: 7.62,27.94 17.78,29.21 22.23,29.53 21.59,25.4 18.41,25.4 10.16,23.5 7.62,26.04 24.13,35.88 45.72,30.48 67.94,27.3 64.14,24.13 67.31,24.13 64.14,22.86 67.31,22.86 22.86,13.34 24.77,13.34 24.77,11.43 19.05,9.53 12.7,40.01 52.07,10.16 49.53,5.4 52.07,5.4 49.53,10.16 54.61,10.16 8.26,17.78 41.27,34.92 38.1,34.92 45.72,34.92 55.88,33.02 40.01,28.57 18.41,40.64 31.43,28.57 7.62,36.2 57.78,35.56 60.33,35.56 62.87,36.2 67.94,36.2 36.2,34.92 50.8,40.64 52.7,40.64 54.61,40.64 52.7,44.13 50.8,44.13 54.61,44.13 56.52,44.13 58.42,44.13 56.52,40.64 58.42,40.64 60.33,40.64 62.23,40.64 60.33,44.13 62.23,44.13 27.3,29.53 22.23,7.62 19.05,1.27 3.17,10.16 1.27,6.99 5.71,6.99 3.17,12.7 3.17,15.24 67.31,20.32 64.14,20.32 55.24,13.97 52.7,13.97 70.48,20.32 70.48,22.86 70.48,24.13 72.71,22.23 8.89,64.14 3.81,61.59 15.88,63.5 29.21,66.04 26.67,60.96 26.67,68.58 42.55,64.14 49.53,63.5 20.32,59.69 20.32,57.78 53.98,57.78 53.98,59.69 38.73,53.98 60.33,68.58 62.87,66.04 60.33,60.96
  pour Top (isolate 0.305): -0.64,44.77 83.19,44.77 83.19,-0.64 -0.64,-0.64
  pour Bottom (isolate 0.305): -0.64,44.77 83.19,44.77 83.19,-0.64 -0.64,-0.64
  pour Top (isolate 0.406): 0.64,88.27 32.38,88.27 32.38,46.35 0.64,46.35
  pour Bottom (isolate 0.406): 0.64,88.27 32.38,88.27 32.38,46.35 0.64,46.35
  pour Top (isolate 0.406): 34.29,88.27 65.41,88.27 65.41,46.35 34.29,46.35
  pour Bottom (isolate 0.406): 34.29,88.27 65.41,88.27 65.41,46.35 34.29,46.35
LIGHT  (via drill 0.5)
  Top 0.254: IC1.19 20.07,35.49 arc22 v19.68,37.47 | v13.97,38.1 13.97,36.96 R6.1
  Bottom 0.254: v19.68,37.47 15.88,37.47 arc-37 v13.97,38.1
N$1
  Top 0.406: SJ1.2 13.97,6.99 arc-77 R2.3
N$2
  Top 0.254: IC1.29 13.54,28.05 arc-42 TP1.PP
N$3
  Top 0.254: R20.2 71.75,22.23 arc87 Q3.1
N$4  (via drill 0.5)
  Top 0.406: SJ1.3 arc41 v17.14,9.53
  Bottom 0.406: SV1.18 19.68,15.24 arc-48 v17.14,9.53
N$5
  Top 0.254: R22.2 arc34 62.55,26.99 63.5,26.99 arc-90 66.04,24.45 66.04,8.89 arc59 X1.2
N$6
  Top 0.254: R19.2 30.61,3.05 arc57 29.84,4.45 arc-61 29.53,5.08 Q2.1
N$7
  Top 0.254: IC1.9 27.48,28.55 arc54 C4.1 R5.2
N$8
  Top 0.406: Q2.3 28.48,8.09 arc40 SG1.-
  Bottom 0.406: D1.A 26.46,4.73 arc47 SG1.-
N$9
  Bottom 0.406: R16.2 18.92,6.93 SG1.+
N$10
  Top 0.254: R24.2 arc-34 62.55,26.35 63.5,26.35 arc-90 65.41,24.45 65.41,8.89 arc-59 X1.1
N$11
  Top 0.406: Q1.1 R6.2
N$12  (via drill 0.5)
  Top 0.406: R22.1 58.61,27.3 v56.52,27.3 IC2.7 | v57.78,24.77 R26.2
  Bottom 0.406: v56.52,27.3 56.52,26.67 arc67 v57.78,24.77
N$13  (via drill 0.5)
  Top 0.406: IC2.6 57.15,26.04 v57.78,26.04 58.61,26.04 R24.1 | v57.78,28.57 R21.1
  Bottom 0.406: v57.78,26.04 v57.78,28.57
N$14
  Top 0.406: SV3.15 37.47,8.89 arc-62 R14.1
N$15
  Top 0.406: SV3.13 40.64,9.53 arc90 39.37,10.79 arc-62 R12.1
N$16
  Top 0.254: IC1.5 34.28,26.55 arc-30 Z1.2 arc-45 41.34,26.86 C2.2
  Bottom 0.254: Z1.2 R3.2
N$17
  Top 0.406: SV3.11 43.18,9.21 arc26 R10.1
N$18
  Top 0.406: SV3.9 45.72,9.21 arc-70 R8.1
N$19
  Top 0.406: 29.97,11.94 R15.1 arc59 37.47,7.62 arc-90 38.1,6.99 SV3.16
N$20
  Top 0.406: SV3.14 arc-53 39.37,8.89 arc90 38.1,10.16 arc-58 R13.1
N$21
  Top 0.406: SV3.12 arc-53 41.91,8.89 arc64 R11.1
N$22
  Top 0.406: SV3.10 arc-53 44.45,8.89 arc-24 R9.1
N$23
  Top 0.254: Q4.1 arc-72 72.39,26.04 72.39,26.67 arc-38 R23.2
N$24
  Top 0.254: Q5.1 74.47,27.48 arc-42 R27.2
N$25
  Top 0.406: SV4.4 77.94,19.68 arc90 Q3.3
N$26
  Top 0.406: Q4.3 SV4.3
N$27
  Top 0.406: SV4.2 77.94,24.77 arc-90 Q5.3
N$28
  Top 0.254: IC1.1 25.29,24.55 arc-41 TP3.PP
N$29
  Top 0.254: IC1.32 15.12,26.55 arc52 TP2.PP
N$30
  Top 0.254: IC1.18 20.57,37.53 arc9 TP4.PP
N$31  (via drill 0.5)
  Top 0.406: v17.46,69.85 IC3.7
  Bottom 0.406: X2.3 16.51,70.8 v17.46,69.85
N$32
  Top 0.406: IC3.6 C16.2
N$33
  Top 0.406: C15.2 18.41,60.96 17.78,61.59 17.78,62.87 18.41,63.5 IC3.2
N$34
  Top 0.813: C17.1 29.21,76.66 X2.G1 29.03,80.82 26.67,83.19 6.35,83.19 3.99,80.82 X2.G2
N$35
  Top 0.406: X2.4 13.77,79.17 14.61,80.01 19.68,80.01 20.62,79.07 X2.6 22,76.73 X2.1
N$36
  Top 0.406: IC3.5 24.13,67.31 24.51,66.93 C18.1
N$37
  Top 0.406: IC3.4 C18.2
N$38
  Top 0.406: IC3.3 21.21,64.77 C19.2
N$39
  Top 0.406: IC3.1 24.13,62.23 24.51,62.61 C19.1
N$40  (via drill 0.5)
  Top 0.406: IC4.7 v8.26,59.69 8.89,59.05 R33.1 | R32.2 v5.08,59.69
  Bottom 0.406: v5.08,59.69 v8.26,59.69
N$41  (via drill 0.5)
  Top 0.406: R34.1 IC4.6 v6.99,63.5 | v10.79,59.69 R31.1
  Bottom 0.406: v6.99,63.5 v10.79,59.69
N$42
  Top 0.406: R33.2 8.89,54.61 9.53,53.98 12.22,53.98 X3.2
N$43
  Top 0.406: R34.2 6.99,54.61 8.89,52.7 9.99,52.7 X3.1
N$44
  Top 0.406: X2.2 19.25,71.45 IC3.8
N$45
  Top 0.406: IC3.14 15.56,64.77 16.19,65.41 16.19,72.71 17.88,74.4 X2.7
N$46
  Top 0.406: X2.8 15.14,66.57 14.61,66.04 IC3.13
N$47
  Top 0.406: R39.2 38.35,63.75 40.64,66.04 IC6.3 IC6.2 41.91,66.67 42.55,66.04 43.81,66.04 45.09,67.31 IC5.12 IC5.11
N$48
  Top 0.406: IC3.9 6.99,71.12 5.71,69.85 IC4.4
N$49
  Top 0.406: IC3.10 10.16,69.85 9.53,69.22 IC4.1
N$50
  Top 0.406: R30.1 LED1.A
N$51
  Top 0.406: IC5.6 C23.2
N$52
  Top 0.406: C22.2 52.07,60.96 51.44,61.59 51.44,62.87 52.07,63.5 IC5.2
N$53
  Top 0.813: X4.G2 37.64,80.82 40.01,83.19 60.33,83.19 62.69,80.82 X4.G1 62.87,76.66 C24.1
N$54
  Top 0.406: X4.4 47.42,79.17 48.26,80.01 53.34,80.01 54.28,79.07 X4.6 55.65,76.73 X4.1
N$55
  Top 0.406: C25.1 58.17,66.93 57.78,67.31 IC5.5
N$56
  Top 0.406: IC5.4 C25.2
N$57
  Top 0.406: IC5.3 54.61,64.77 55.88,63.5 C26.2
N$58
  Top 0.406: IC5.1 57.78,62.23 58.17,62.61 C26.1
N$59  (via drill 0.5)
  Top 0.406: IC6.7 41.91,60.33 v42.55,59.69 R37.1 | R36.2 v38.73,59.69
  Bottom 0.406: v38.73,59.69 v42.55,59.69
N$60  (via drill 0.5)
  Top 0.406: R38.1 IC6.6 v40.64,63.5 | v44.45,59.69 R35.1
  Bottom 0.406: v40.64,63.5 v44.45,59.69
N$61
  Top 0.406: R37.2 42.55,54.61 43.18,53.98 45.88,53.98 X5.2
N$62
  Top 0.406: R38.2 40.64,54.61 42.55,52.7 43.65,52.7 X5.1
N$63  (via drill 0.5)
  Top 0.406: v51.12,69.85 IC5.7
  Bottom 0.406: X4.3 50.16,70.8 v51.12,69.85
N$64
  Top 0.406: X4.2 52.91,71.45 IC5.8
N$65
  Top 0.406: X4.7 51.54,74.08 49.85,72.39 49.85,65.72 48.9,64.77 IC5.14
N$66
  Top 0.406: X4.8 48.79,66.57 48.26,66.04 IC5.13
N$68
  Top 0.406: IC5.9 40.64,71.12 39.37,69.85 IC6.4
N$69
  Top 0.406: IC5.10 43.81,69.85 43.18,69.22 IC6.1
N$70
  Top 0.406: R39.1 LED2.A
N$71
  Top 0.406: R30.2 4.7,63.75 6.99,66.04 IC4.3 IC4.2 8.26,66.04 8.89,65.41 10.16,65.41 12.06,67.31 IC3.12 IC3.11
OUT1  (via drill 0.5)
  Top 0.254: IC1.2 32.41,25.05 arc-57 34.29,23.81 arc62 35.88,22.86 38.1,22.86 arc19 v41.91,23.5 | v71.75,33.66 R20.1
  Bottom 0.254: v71.75,33.66 71.75,40.01 arc90 69.85,41.91 46.99,41.91 arc90 43.81,38.73 43.81,27.94 arc-46 v41.91,23.5
OUT2  (via drill 0.5)
  Top 0.254: IC1.3 32.87,25.55 arc-59 34.61,24.45 arc62 36.2,23.5 38.1,23.5 arc31 v41.59,24.45 | v73.66,33.66 R23.1
  Bottom 0.254: v41.59,24.45 arc49 43.18,27.94 43.18,38.73 arc-90 46.99,42.55 69.85,42.55 arc-90 72.39,40.01 72.39,37.47 arc37 v73.66,33.66
OUT3  (via drill 0.5)
  Top 0.254: IC1.4 33.32,26.05 arc-62 34.92,25.08 arc62 36.51,24.13 38.1,24.13 arc44 v41.27,25.4 | v75.56,33.66 R27.1
  Bottom 0.254: v41.27,25.4 arc53 42.55,27.94 42.55,38.73 arc-90 46.99,43.18 69.85,43.18 arc-90 73.03,40.01 73.03,37.47 arc67 v75.56,33.66
PA0  (via drill 0.5)
  Top 0.254: IC1.10 25.88,29.05 26.35,29.53 26.35,34.61 arc-90 27.94,36.2 46.35,36.2 arc-37 48.26,35.56 arc37 50.16,34.92 51.44,34.92 v51.75,34.61
  Bottom 0.254: v51.75,34.61 arc16 51.44,32.38 51.44,23.5 arc90 56.52,18.41 57.15,18.41 arc-90 59.05,16.51 59.05,14.61 arc-42 SV3.2
PA1  (via drill 0.5)
  Top 0.254: IC1.11 25.43,29.55 25.72,29.84 25.72,34.61 arc-90 27.94,36.83 46.35,36.83 arc-37 48.26,36.2 arc37 50.16,35.56 52.39,35.56 v52.7,35.24
  Bottom 0.254: v52.7,35.24 arc-34 52.39,33.66 arc28 52.07,32.38 52.07,23.5 arc90 56.52,19.05 57.78,19.05 arc-90 61.59,15.24 arc-46 57.78,6.35 arc3 57.15,5.71 arc-53 55.88,5.08 arc-53 SV3.4
PA2  (via drill 0.5)
  Top 0.254: IC1.12 24.66,30.05 25.08,30.48 25.08,34.61 arc-90 27.94,37.47 46.35,37.47 arc-37 48.26,36.83 arc37 50.16,36.2 53.34,36.2 v53.66,35.88
  Bottom 0.254: v53.66,35.88 arc-24 53.02,33.66 arc28 52.7,32.38 52.7,23.5 arc90 56.52,19.68 59.69,19.68 arc-90 64.14,15.24 arc-64 57.78,5.08 arc-24 55.24,4.45 52.07,4.45 arc-90 50.8,5.71 SV3.6
PA3  (via drill 0.5)
  Top 0.254: v54.61,36.83 50.16,36.83 arc-37 48.26,37.47 arc37 46.35,38.1 25.4,38.1 arc90 23.07,35.77 IC1.13
  Bottom 0.254: v54.61,36.83 54.61,35.56 arc-44 53.98,33.97 arc44 53.34,32.38 53.34,23.5 arc90 56.52,20.32 59.69,20.32 arc-90 64.77,15.24 arc-66 57.78,4.45 arc-26 54.61,3.81 51.44,3.81 arc-48 48.58,5.08 arc-56 SV3.8
PA4  (via drill 0.5)
  Top 0.254: v51.75,37.78 49.21,37.78 arc-37 48.26,38.1 arc37 46.35,38.73 25.4,38.73 arc90 22.57,35.91 IC1.14
  Bottom 0.254: SV3.1 55.88,12.06 arc-17 56.2,13.97 arc25 56.52,17.14 arc77 55.88,17.78 arc-83 50.8,23.5 50.8,34.61 arc-33 v51.75,37.78
PA5  (via drill 0.5)
  Top 0.254: v50.8,38.73 48.9,38.73 arc-28 47.62,39.05 arc28 46.35,39.37 25.4,39.37 arc90 22.07,36.04 IC1.15
  Bottom 0.254: v50.8,38.73 arc17 50.16,34.61 50.16,23.5 arc58 53.34,17.78 arc-63 53.98,16.51 53.98,15.24 arc-11 SV3.3
PA6  (via drill 0.5)
  Top 0.254: IC1.16 21.57,36.17 arc-90 25.4,40.01 46.35,40.01 arc-16 48.58,39.69 arc33 v49.85,39.69
  Bottom 0.254: v49.85,39.69 arc7 49.53,34.61 49.53,24.13 arc28 50.8,19.05 arc-28 51.44,16.51 51.44,15.24 arc-11 SV3.5
PA7  (via drill 0.5)
  Top 0.254: v48.9,40.64 25.4,40.64 arc90 21.07,36.31 IC1.17
  Bottom 0.254: SV3.7 48.26,14.61 48.9,15.24 v48.9,40.64
RS  (via drill 0.5)
  Top 0.254: IC1.40 19.07,21.29 arc-38 v18.73,20.32 | SV1.4 arc37 43.81,19.68 33.97,19.68 arc-37 33.02,20 arc37 32.07,20.32 28.26,20.32 arc-23 v26.67,20.64 | SV2.4 arc-53 5.4,23.81 arc46 v7.62,24.77
  Bottom 0.254: v7.62,24.77 7.62,24.45 10.95,21.11 arc49 12.7,20.32 v18.73,20.32 arc-12 24.77,20.95 25.4,20.95 arc-28 v26.67,20.64
RST  (via drill 0.5)
  Top 0.254: v19.68,28.57 19.57,28.69 IC1.20 19.57,35.36 arc81 R7.2
  Bottom 0.254: v19.68,28.57 27.3,28.57 arc-90 31.75,24.13 31.75,22.23 arc-62 29.84,19.05 arc-28 24.77,17.78 24.13,17.78 arc90 SV1.17
RW  (via drill 0.5)
  Top 0.254: IC1.41 19.57,20.52 arc-48 v19.05,19.37 | SV1.5 arc39 43.81,19.05 33.66,19.05 arc-37 32.7,19.37 arc37 31.75,19.68 27.3,19.68 arc-23 v25.72,20
  Bottom 0.254: v25.72,20 arc37 24.77,20.32 arc19 v19.05,19.37 arc16 16.83,19.68 12.7,19.68 arc-37 10.79,20.32 6.67,24.45 arc37 SV2.5
RXD1  (via drill 0.5)
  Top 0.254: IC1.31 15.31,27.05 arc19 v11.75,26.67 | IC2.1 arc106 44.77,27.3 44.77,23.81 arc-90 42.55,21.59 34.92,21.59 arc-37 33.97,21.91 arc37 33.02,22.23 31.11,22.23 arc-23 v29.53,22.54
  Bottom 0.254: v29.53,22.54 arc14 26.99,22.86 16.51,22.86 arc-28 13.97,23.5 arc-54 v11.75,26.67
SWCLK
  Top 0.254: 17.57,23.29 IC1.37 arc42 16.51,20.32 arc-53 15.88,19.05 11.43,14.61 arc46 9.53,10.16 9.53,4.76 arc67 10.16,3.81 arc-45 JP1.3
  Bottom 0.254: JP1.3 R28.1
SWDIO
  Top 0.254: IC1.34 16.83,25.55 arc-99 17.14,24.13 arc37 15.88,20.32 arc-37 15.56,19.68 10,14.13 arc-49 8.26,13.34 arc90 6.99,12.06 arc53 7.62,10.79 arc-44 8.26,9.21 8.26,5.71 arc41 JP1.2
  Bottom 0.254: R29.1 JP1.2
TXD1  (via drill 0.5)
  Top 0.254: IC1.30 12,27.55 arc73 10.79,26.67 v10.79,26.04 | IC2.4 arc-88 42.55,20.95 34.61,20.95 arc-37 33.66,21.27 arc37 32.7,21.59 30.16,21.59 arc-23 v28.57,21.91
  Bottom 0.254: v28.57,21.91 arc23 26.99,22.23 16.51,22.23 arc-40 13.02,23.5 arc-18 v10.79,26.04
VCC  (1 unrouted)
  Top 0.406: IC4.8 10.06,62.23 IC3.16 13.44,61.11 C14.1 C20.1 14.22,56.39 13.97,56.13 | R31.2 13.97,56.13 | 13.97,56.13 17.06,56.13 X3.4 | IC6.8 43.71,62.23 IC5.16 47.09,61.11 C21.1 C27.1 47.88,56.52 48.26,56.13 | R35.2 48.26,56.13 | 48.26,56.13 50.72,56.13 X5.4
  Bottom 0.813: X2.9 12.39,79.7 13.34,80.64 23.5,80.64 24.77,79.38 24.77,54.44 X3.4 | X4.9 46.05,80.97 46.99,81.92 57.15,81.92 58.42,80.64 58.42,54.44 X5.4
VO  (via drill 0.5)
  Top 0.254: v22.23,8.89 arc90 19.05,12.06 12.7,12.06 arc-53 v11.43,12.7
  Top 0.305: v34.92,5.08 45.72,5.08 arc90 46.99,6.35 arc-90 48.26,7.62 55.88,7.62 arc90 57.78,9.53 SV1.3
  Bottom 0.305: R2.2 arc-37 v11.43,12.7 | v22.23,8.89 26.04,8.89 arc-46 v34.92,5.08
  Bottom 0.406: SV2.3 arc-64 6.99,20 6.99,15.88 arc37 R2.2
XTAL2
  Top 0.254: IC1.6 34.55,27.05 arc86 Z1.1 arc-42 41.21,31.56 C3.2
  Bottom 0.254: Z1.1 R3.1

### Text on the board
Bottom: i@tuxotronic.org
tPlace: A+ | B- | G | +5V | LCD VT100 | tuxotronic.org | Rev.A 25-11-2012 | A+ | B- | G | +5V